# Altium schematic sheet Main.SchDoc
size 431 x 279 mm; SheetNumber: 1; SheetTotal: 1; ENG_APP_DATE: --/--/--; DSN_APP_DATE: --/--/--; CHK_APP_DATE: --/--/--
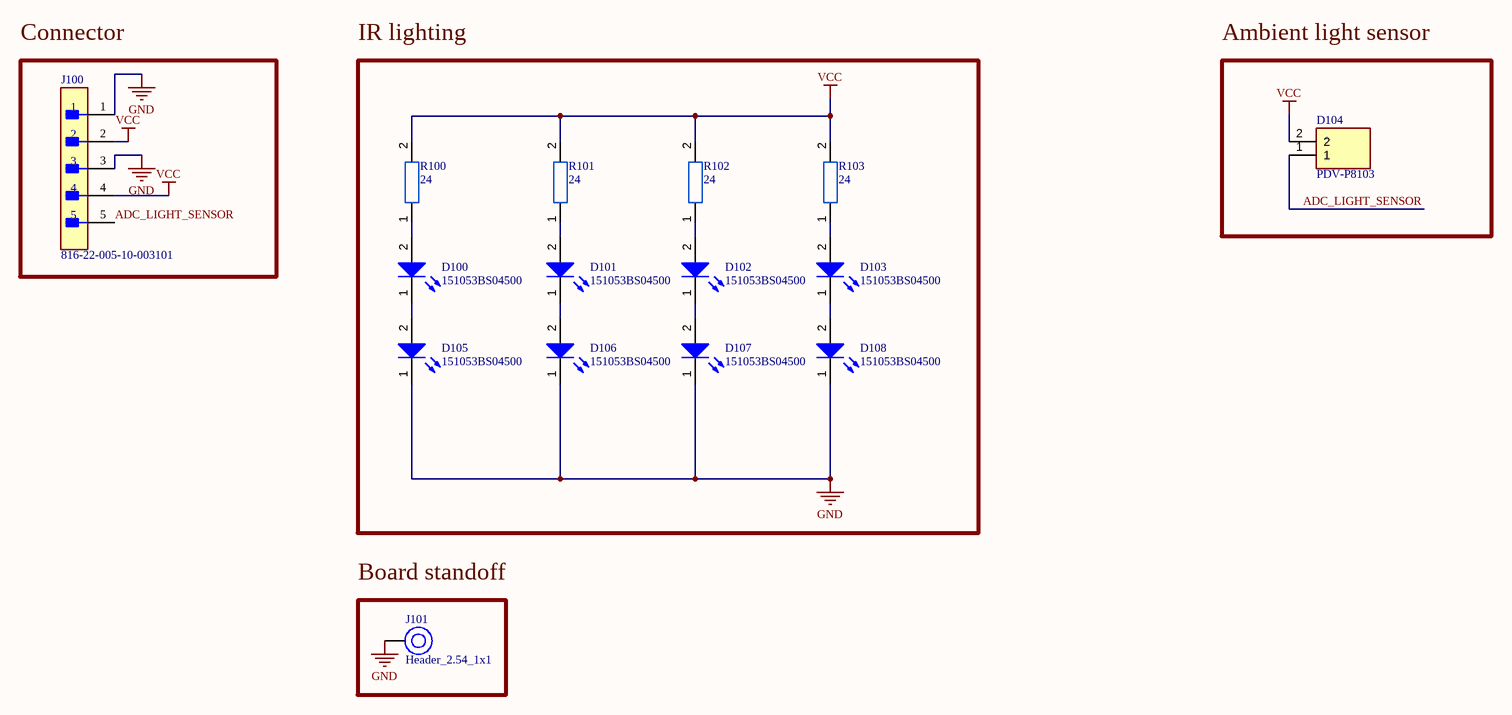
[diagram p0: Main.SchDoc]

## Parts
D100  151053BS04500  [WL-TMRW_D5.8H11.7]
D101  151053BS04500  [WL-TMRW_D5.8H11.7]
D102  151053BS04500  [WL-TMRW_D5.8H11.7]
D103  151053BS04500  [WL-TMRW_D5.8H11.7]
D104  PDV-P8103  [PDVP8103]
D105  151053BS04500  [WL-TMRW_D5.8H11.7]
D106  151053BS04500  [WL-TMRW_D5.8H11.7]
D107  151053BS04500  [WL-TMRW_D5.8H11.7]
D108  151053BS04500  [WL-TMRW_D5.8H11.7]
J100  816-22-005-10-003101  [FP-816-22-005-10-003101-MFG]
J101  Header_2.54_1x1  [HEADER_2.54_1x1]
R100  24  [0402_footprint]
R101  24  [0402_footprint]
R102  24  [0402_footprint]
R103  24  [0402_footprint]

## Blocks framed on the sheet
Connector: J100
IR lighting: D100-D103 D105-D108 R100-R103
Ambient light sensor: D104
Board standoff: J101

## Nets
GND: D105.1(K) D106.1(K) D107.1(K) D108.1(K) J100.1 J100.3 J101.0
VCC: D104.2 J100.2 J100.4 R100.2 R101.2 R102.2 R103.2
ADC_LIGHT_SENSOR: D104.1 J100.5
NetD100_1: D100.1(K) D105.2(A)
NetD100_2: D100.2(A) R100.1
NetD101_1: D101.1(K) D106.2(A)
NetD101_2: D101.2(A) R101.1
NetD102_1: D102.1(K) D107.2(A)
NetD102_2: D102.2(A) R102.1
NetD103_1: D103.1(K) D108.2(A)
NetD103_2: D103.2(A) R103.1

## Notes on the sheet
- DWG. NO.
- REV.
- SHT.
- THIS DOCUMENT AND THE DATA DISCLOSED HEREIN OR HEREWITH IS THE PROPERTY OF ALTIUM LIMITED AND MAY BE FREELY DISTRIBUTED IN WHOLE. NO RIGHTS ARE RESERVED OR EXPRESS OR IMPLIED WARANTEE GIVEN.
- REVISION
- DESCRIPTION
- DATE
- APPROVED
- ENG:
- APPROVALS
- PROJECT
- DSN:
- CHK:
- REFERENCE DOCUMENTS
- PROJECT REVISION:
- TITLE
- DOCUMENT REVISION:
- DESIGN ITEM:
- BOM:
- FAB DWG:
- PCB DWG:
- ASSY DWG:
- SCALE:
- SIZE
- B
- CAGE CODE
- FILE NAME
- DWG NO.
- SHEET
- OF
- REV

## Library data of the parts
D100-D102 D105-D108 = CMP-1489-00006-2: NexarPartId: 29717816; Peak Wavelength: 461nm; Luminous Intensity: 2cd; Dominant Wavelength: 465nm; Test Current: 20mA; Lens Style: Circular, Clear, Round; Forward Voltage: 2.7V; Forward Current: 100mA; Viewing Angle: 45°; Lens Size: 5mm; Color: Blue; Max Reverse Voltage (DC): 5V; Max Operating Temperature: 85°C; Wavelength: 465nm; REACH SVHC: Unknown; Height: 8.6mm; Min Operating Temperature: -40°C; Width: 5mm; RoHS: Compliant; Mount: Through Hole; Length: 5mm; Case/Package: Radial; Packaging: Bulk; ComponentLink1Description: Buy
  D100 D101 D105 D106: ComponentLink1URL: https://www.mouser.lt/ProductDetail/Vishay-Semiconductors/TSAL6400?qs=oSAwVt7aKTHCOCv1ythi7g%3D%3D
  D102 D107 D108: ComponentLink1URL: https://www.mouser.lt/ProductDetail/Vishay-Semiconductors/TSHF5210?qs=%2Fjqivxn91cfAnyW9i5Zlpg%3D%3D
D103 = CMP-1489-00006-2: https://www.lemona.lt/sviesos-diodas-o5mm-ir-skaidrus-30.html; NexarPartId: 29717816; Peak Wavelength: 461nm; Luminous Intensity: 2cd; Dominant Wavelength: 465nm; Test Current: 20mA; Lens Style: Circular, Clear, Round; Forward Voltage: 2.7V; Forward Current: 100mA; Viewing Angle: 45°; Lens Size: 5mm; Color: Blue; Max Reverse Voltage (DC): 5V; Max Operating Temperature: 85°C; Wavelength: 465nm; REACH SVHC: Unknown; Height: 8.6mm; Min Operating Temperature: -40°C; Width: 5mm; RoHS: Compliant; Mount: Through Hole; Length: 5mm; Case/Package: Radial; Packaging: Bulk; ComponentLink1Description: Buy; ComponentLink1URL: https://www.mouser.lt/ProductDetail/Vishay-Semiconductors/TSHF5210?qs=%2Fjqivxn91cfAnyW9i5Zlpg%3D%3D
D104 = PDV-P8103: Manufacturer_Name: ADVANCED PHOTONIX; Datasheet Link: https://media.digikey.com/pdf/Data%20Sheets/Photonic%20Detetectors%20Inc%20PDFs/PDV-P8103.pdf; Height: 2.38mm; Manufacturer_Part_Number: PDV-P8103; ComponentLink1Description: Buy; ComponentLink1URL: https://www.mouser.lt/ProductDetail/Advanced-Photonix/PDV-P8103?qs=tlsG%2FOw5FFiMv0vIkPUhuA%3D%3D
J100 = CMP-07791-000028-1: CONN SPRING PISTON 5POS PCB; Number of Contacts: 5; Voltage Rating: 150V; Pitch: 2.54mm; Current Rating: 2A; Insulation Resistance: 10GR; Material: Copper Alloy; RoHS Compliant: Yes; Mount: Through Hole; Contact Gender: Male; Contact Material: Copper Alloy; Number of Positions: 5; Flammability Rating: UL94 V-0; Housing Material: Thermoplastic; Package Quantity: 1; Number of Rows: 1; Contact Plating: Gold; Series: 816; Termination: Through Hole; Packaging: Bulk
R100-R103 = Resistor_0402: 0402 resistor